# Altium schematic sheet BTF16.SchDoc
size A
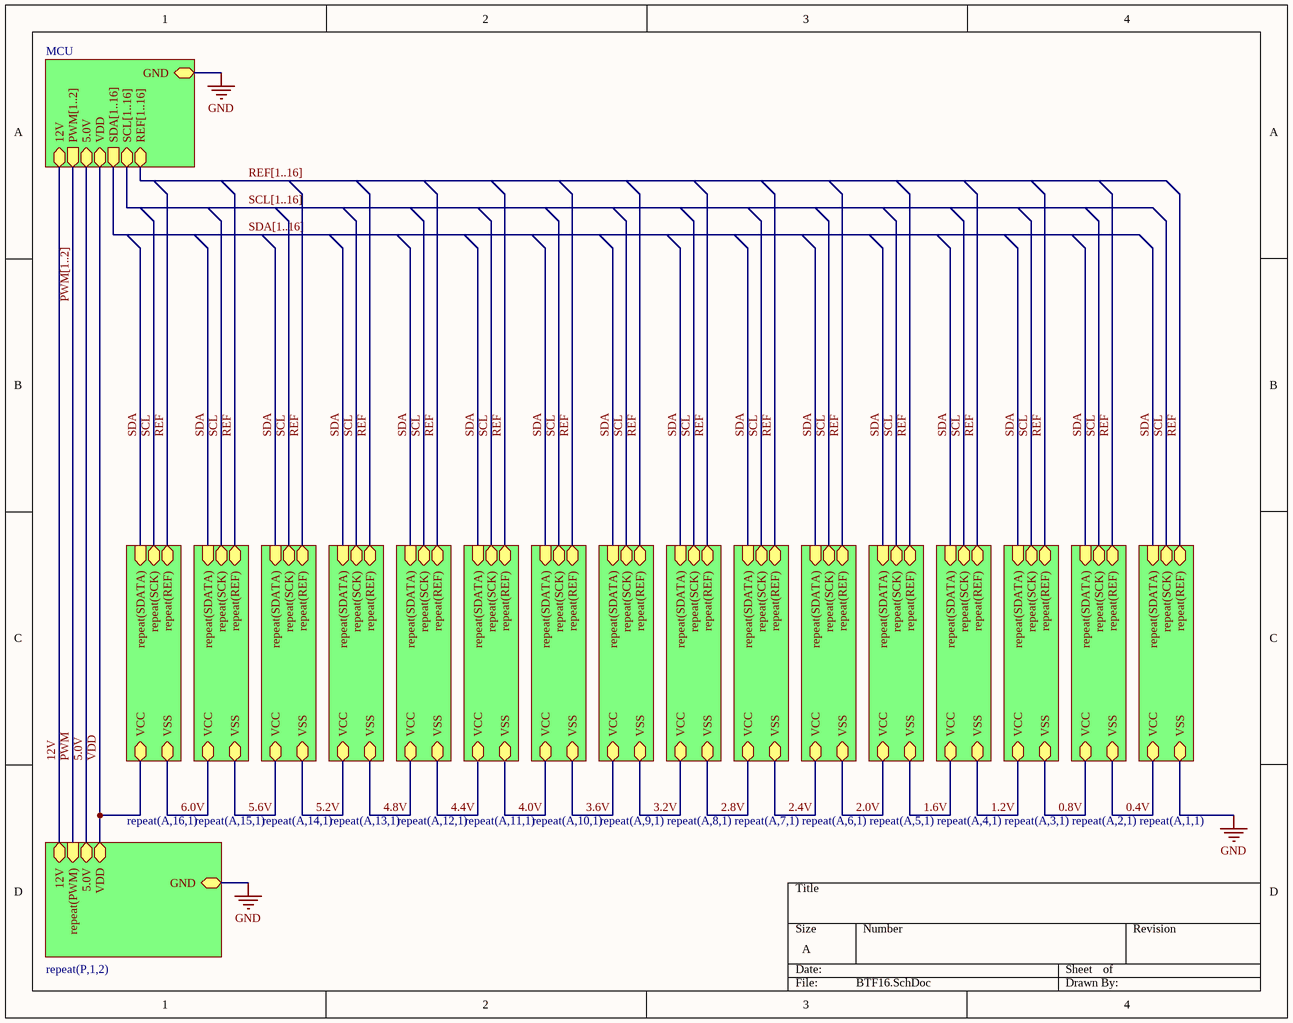
[diagram p0: BTF16.SchDoc]

## Sub-sheets
MCU = MCU.SchDoc: VDD, GND, SDA[1..16] (out), SCL[1..16], 12V, REF[1..16], 5.0V, PWM[1..2] (out)
repeat(A,1,1) = ASIC.SchDoc: VCC, VSS, repeat(SDATA) (in), repeat(SCK), repeat(REF)
repeat(A,2,1) = ASIC.SchDoc: VCC, VSS, repeat(SDATA) (in), repeat(SCK), repeat(REF)
repeat(A,3,1) = ASIC.SchDoc: VCC, VSS, repeat(SDATA) (in), repeat(SCK), repeat(REF)
repeat(A,4,1) = ASIC.SchDoc: VCC, VSS, repeat(SDATA) (in), repeat(SCK), repeat(REF)
repeat(A,5,1) = ASIC.SchDoc: VCC, VSS, repeat(SDATA) (in), repeat(SCK), repeat(REF)
repeat(A,6,1) = ASIC.SchDoc: VCC, VSS, repeat(SDATA) (in), repeat(SCK), repeat(REF)
repeat(A,7,1) = ASIC.SchDoc: VCC, VSS, repeat(SDATA) (in), repeat(SCK), repeat(REF)
repeat(A,8,1) = ASIC.SchDoc: VCC, VSS, repeat(SDATA) (in), repeat(SCK), repeat(REF)
repeat(A,9,1) = ASIC.SchDoc: VCC, VSS, repeat(SDATA) (in), repeat(SCK), repeat(REF)
repeat(A,10,1) = ASIC.SchDoc: VCC, VSS, repeat(SDATA) (in), repeat(SCK), repeat(REF)
repeat(A,11,1) = ASIC.SchDoc: VCC, VSS, repeat(SDATA) (in), repeat(SCK), repeat(REF)
repeat(A,12,1) = ASIC.SchDoc: VCC, VSS, repeat(SDATA) (in), repeat(SCK), repeat(REF)
repeat(A,13,1) = ASIC.SchDoc: VCC, VSS, repeat(SDATA) (in), repeat(SCK), repeat(REF)
repeat(A,14,1) = ASIC.SchDoc: VCC, VSS, repeat(SDATA) (in), repeat(SCK), repeat(REF)
repeat(A,15,1) = ASIC.SchDoc: VCC, VSS, repeat(SDATA) (in), repeat(SCK), repeat(REF)
repeat(A,16,1) = ASIC.SchDoc: VCC, VSS, repeat(SDATA) (in), repeat(SCK), repeat(REF)
repeat(P,1,2) = POWER.SchDoc: GND, VDD, 12V, 5.0V, repeat(PWM) (in)

## Nets
GND: sheet MCU/GND, sheet repeat(P,1,2)/GND, sheet repeat(A,1,1)/VSS
0.4V: sheet repeat(A,1,1)/VCC, sheet repeat(A,2,1)/VSS
0.8V: sheet repeat(A,2,1)/VCC, sheet repeat(A,3,1)/VSS
1.2V: sheet repeat(A,4,1)/VSS, sheet repeat(A,3,1)/VCC
1.6V: sheet repeat(A,4,1)/VCC, sheet repeat(A,5,1)/VSS
2.0V: sheet repeat(A,5,1)/VCC, sheet repeat(A,6,1)/VSS
2.4V: sheet repeat(A,6,1)/VCC, sheet repeat(A,7,1)/VSS
2.8V: sheet repeat(A,7,1)/VCC, sheet repeat(A,8,1)/VSS
3.2V: sheet repeat(A,8,1)/VCC, sheet repeat(A,9,1)/VSS
3.6V: sheet repeat(A,9,1)/VCC, sheet repeat(A,10,1)/VSS
4.0V: sheet repeat(A,10,1)/VCC, sheet repeat(A,11,1)/VSS
4.4V: sheet repeat(A,12,1)/VSS, sheet repeat(A,11,1)/VCC
4.8V: sheet repeat(A,12,1)/VCC, sheet repeat(A,13,1)/VSS
5.0V: sheet MCU/5.0V, sheet repeat(P,1,2)/5.0V
5.2V: sheet repeat(A,13,1)/VCC, sheet repeat(A,14,1)/VSS
5.6V: sheet repeat(A,14,1)/VCC, sheet repeat(A,15,1)/VSS
6.0V: sheet repeat(A,15,1)/VCC, sheet repeat(A,16,1)/VSS
12V: sheet MCU/12V, sheet repeat(P,1,2)/12V
PWM: sheet repeat(P,1,2)/repeat(PWM)
REF: sheet repeat(A,1,1)/repeat(REF), sheet repeat(A,2,1)/repeat(REF), sheet repeat(A,4,1)/repeat(REF), sheet repeat(A,3,1)/repeat(REF), sheet repeat(A,5,1)/repeat(REF), sheet repeat(A,6,1)/repeat(REF), sheet repeat(A,7,1)/repeat(REF), sheet repeat(A,8,1)/repeat(REF), sheet repeat(A,9,1)/repeat(REF), sheet repeat(A,10,1)/repeat(REF), sheet repeat(A,12,1)/repeat(REF), sheet repeat(A,13,1)/repeat(REF), sheet repeat(A,14,1)/repeat(REF), sheet repeat(A,15,1)/repeat(REF), sheet repeat(A,16,1)/repeat(REF), sheet repeat(A,11,1)/repeat(REF)
SCL: sheet repeat(A,1,1)/repeat(SCK), sheet repeat(A,2,1)/repeat(SCK), sheet repeat(A,4,1)/repeat(SCK), sheet repeat(A,3,1)/repeat(SCK), sheet repeat(A,5,1)/repeat(SCK), sheet repeat(A,6,1)/repeat(SCK), sheet repeat(A,7,1)/repeat(SCK), sheet repeat(A,8,1)/repeat(SCK), sheet repeat(A,9,1)/repeat(SCK), sheet repeat(A,10,1)/repeat(SCK), sheet repeat(A,12,1)/repeat(SCK), sheet repeat(A,13,1)/repeat(SCK), sheet repeat(A,14,1)/repeat(SCK), sheet repeat(A,15,1)/repeat(SCK), sheet repeat(A,16,1)/repeat(SCK), sheet repeat(A,11,1)/repeat(SCK)
SDA: sheet repeat(A,1,1)/repeat(SDATA), sheet repeat(A,2,1)/repeat(SDATA), sheet repeat(A,4,1)/repeat(SDATA), sheet repeat(A,3,1)/repeat(SDATA), sheet repeat(A,5,1)/repeat(SDATA), sheet repeat(A,6,1)/repeat(SDATA), sheet repeat(A,7,1)/repeat(SDATA), sheet repeat(A,8,1)/repeat(SDATA), sheet repeat(A,9,1)/repeat(SDATA), sheet repeat(A,10,1)/repeat(SDATA), sheet repeat(A,12,1)/repeat(SDATA), sheet repeat(A,13,1)/repeat(SDATA), sheet repeat(A,14,1)/repeat(SDATA), sheet repeat(A,15,1)/repeat(SDATA), sheet repeat(A,16,1)/repeat(SDATA), sheet repeat(A,11,1)/repeat(SDATA)
VDD: sheet MCU/VDD, sheet repeat(P,1,2)/VDD, sheet repeat(A,16,1)/VCC

## Buses and harness runs
bus PWM[1..2] = sheet MCU/PWM[1..2]
bus REF[1..16] = sheet MCU/REF[1..16]
bus SCL[1..16] = sheet MCU/SCL[1..16]
bus SDA[1..16] = sheet MCU/SDA[1..16]